# Altium schematic sheet filters.SchDoc
size 381 x 241 mm; SheetNumber: 5; SheetTotal: 12
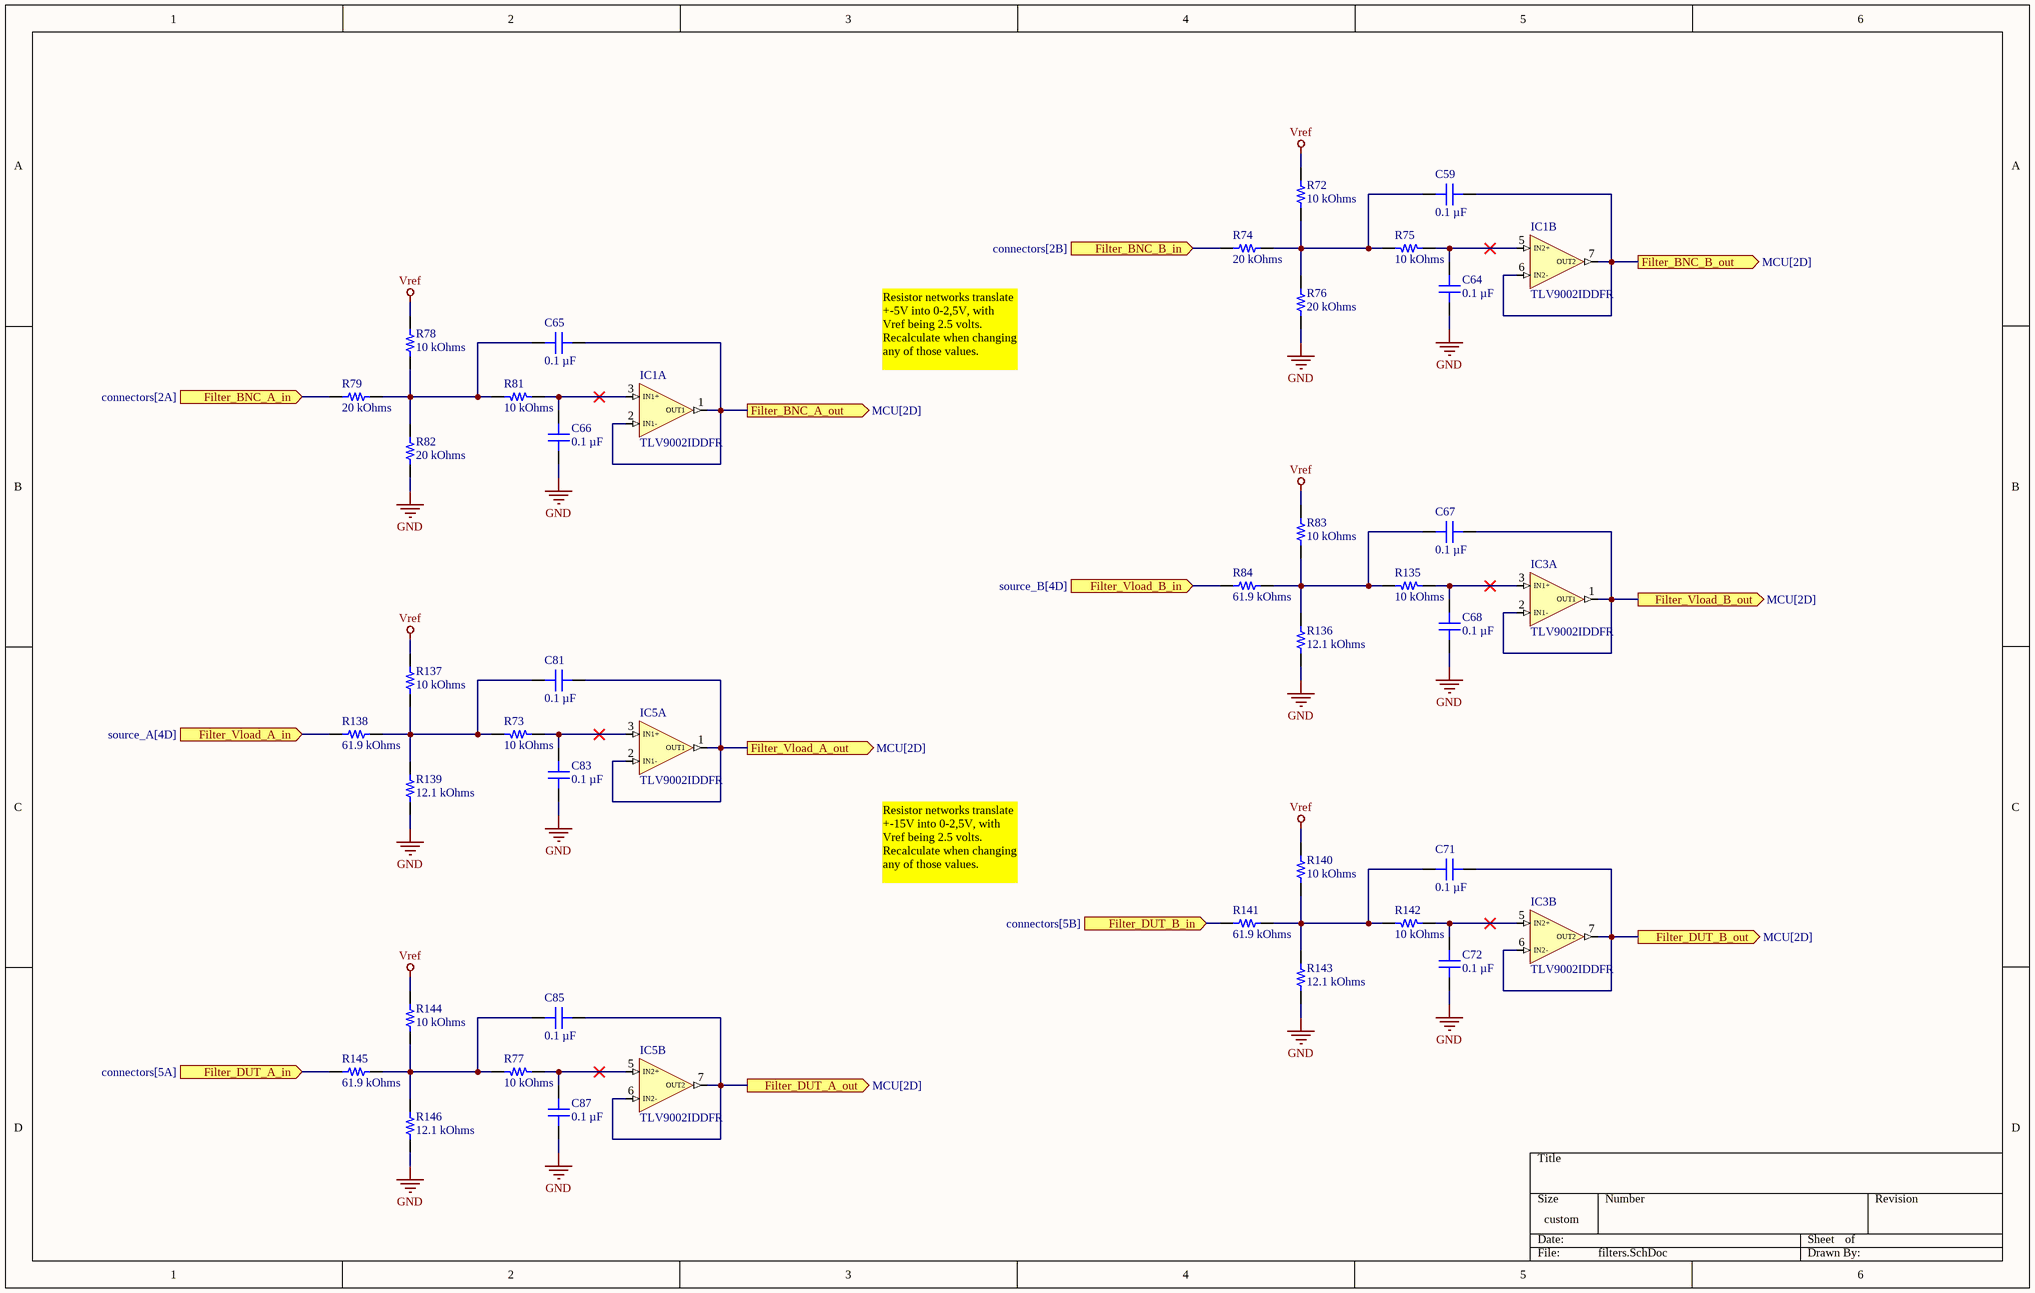
[diagram p0: filters.SchDoc]

## Parts
C59  0.1 µF  [CAP 1206_3216 - 0.8MM]
C64  0.1 µF  [CAP 1206_3216 - 0.8MM]
C65  0.1 µF  [CAP 1206_3216 - 0.8MM]
C66  0.1 µF  [CAP 1206_3216 - 0.8MM]
C67  0.1 µF  [CAP 1206_3216 - 0.8MM]
C68  0.1 µF  [CAP 1206_3216 - 0.8MM]
C71  0.1 µF  [CAP 1206_3216 - 0.8MM]
C72  0.1 µF  [CAP 1206_3216 - 0.8MM]
C81  0.1 µF  [CAP 1206_3216 - 0.8MM]
C83  0.1 µF  [CAP 1206_3216 - 0.8MM]
C85  0.1 µF  [CAP 1206_3216 - 0.8MM]
C87  0.1 µF  [CAP 1206_3216 - 0.8MM]
IC1  TLV9002IDDFR  [SOT65P280X110-8N]  (parts A,B of 3)
IC3  TLV9002IDDFR  [SOT65P280X110-8N]  (parts A,B of 3)
IC5  TLV9002IDDFR  [SOT65P280X110-8N]  (parts A,B of 3)
R72  10 kOhms  [RES 1206_3216]
R73  10 kOhms  [YAGEO RES 1206_3216]
R74  20 kOhms  [RES 1206_3216]
R75  10 kOhms  [YAGEO RES 1206_3216]
R76  20 kOhms  [RES 1206_3216]
R77  10 kOhms  [YAGEO RES 1206_3216]
R78  10 kOhms  [RES 1206_3216]
R79  20 kOhms  [RES 1206_3216]
R81  10 kOhms  [YAGEO RES 1206_3216]
R82  20 kOhms  [RES 1206_3216]
R83  10 kOhms  [RES 1206_3216]
R84  61.9 kOhms  [RES 1206_3216]
R135  10 kOhms  [YAGEO RES 1206_3216]
R136  12.1 kOhms  [RES 1206_3216]
R137  10 kOhms  [RES 1206_3216]
R138  61.9 kOhms  [RES 1206_3216]
R139  12.1 kOhms  [RES 1206_3216]
R140  10 kOhms  [RES 1206_3216]
R141  61.9 kOhms  [RES 1206_3216]
R142  10 kOhms  [YAGEO RES 1206_3216]
R143  12.1 kOhms  [RES 1206_3216]
R144  10 kOhms  [RES 1206_3216]
R145  61.9 kOhms  [RES 1206_3216]
R146  12.1 kOhms  [RES 1206_3216]

## Ports
Filter_BNC_A_in (in, see connectors[2A]), Filter_BNC_A_out (out, see MCU[2D]), Filter_BNC_B_in (in, see connectors[2B]), Filter_BNC_B_out (out, see MCU[2D]), Filter_DUT_A_in (in, see connectors[5A]), Filter_DUT_A_out (out, see MCU[2D]), Filter_DUT_B_in (in, see connectors[5B]), Filter_DUT_B_out (out, see MCU[2D]), Filter_Vload_A_in (in, see source_A[4D]), Filter_Vload_A_out (out, see MCU[2D]), Filter_Vload_B_in (in, see source_B[4D]), Filter_Vload_B_out (out, see MCU[2D])

## Nets
GND: C64.2 C66.2 C68.2 C72.2 C83.2 C87.2 R76.2 R82.2 R136.2 R139.2 R143.2 R146.2
Vref: R72.1 R78.1 R83.1 R137.1 R140.1 R144.1
Filter_BNC_A_in: R79.1 ; port Filter_BNC_A_in
Filter_BNC_A_out: C65.1 IC1.1(OUT1) IC1.2(IN1-) ; port Filter_BNC_A_out
Filter_BNC_B_in: R74.1 ; port Filter_BNC_B_in
Filter_BNC_B_out: C59.1 IC1.6(IN2-) IC1.7(OUT2) ; port Filter_BNC_B_out
Filter_DUT_A_in: R145.1 ; port Filter_DUT_A_in
Filter_DUT_A_out: C85.1 IC5.6(IN2-) IC5.7(OUT2) ; port Filter_DUT_A_out
Filter_DUT_B_in: R141.1 ; port Filter_DUT_B_in
Filter_DUT_B_out: C71.1 IC3.6(IN2-) IC3.7(OUT2) ; port Filter_DUT_B_out
Filter_Vload_A_in: R138.1 ; port Filter_Vload_A_in
Filter_Vload_A_out: C81.1 IC5.1(OUT1) IC5.2(IN1-) ; port Filter_Vload_A_out
Filter_Vload_B_in: R84.1 ; port Filter_Vload_B_in
Filter_Vload_B_out: C67.1 IC3.1(OUT1) IC3.2(IN1-) ; port Filter_Vload_B_out
NetC59_2: C59.2 R72.2 R74.2 R75.2 R76.1
NetC64_1: C64.1 IC1.5(IN2+) R75.1
NetC65_2: C65.2 R78.2 R79.2 R81.2 R82.1
NetC66_1: C66.1 IC1.3(IN1+) R81.1
NetC67_2: C67.2 R83.2 R84.2 R135.2 R136.1
NetC68_1: C68.1 IC3.3(IN1+) R135.1
NetC71_2: C71.2 R140.2 R141.2 R142.2 R143.1
NetC72_1: C72.1 IC3.5(IN2+) R142.1
NetC81_2: C81.2 R73.2 R137.2 R138.2 R139.1
NetC83_1: C83.1 IC5.3(IN1+) R73.1
NetC85_2: C85.2 R77.2 R144.2 R145.2 R146.1
NetC87_1: C87.1 IC5.5(IN2+) R77.1

## Notes on the sheet
- Resistor networks translate +-5V into 0-2,5V, with Vref being 2.5 volts. Recalculate when changing any of those values.
- Resistor networks translate +-15V into 0-2,5V, with Vref being 2.5 volts. Recalculate when changing any of those values.

## Library data of the parts
C59 C64-C68 C71 C72 C81 C83 C85 C87 = 885012208087: CAP CER 0.1UF 50V X7R 1206; manufacturer: Würth Elektronik; Tolerance: ±10%; Part Number: 885012208087; Capacitance: 0.1 µF; Applications: General Purpose; componentlink1description: Datasheet; componentlink1url: https://katalog.we-online.de/pbs/datasheet/885012208087.pdf; componentlink2description: DigiKey Link; componentlink2url: https://www.digikey.com/en/products/detail/würth-elektronik/885012208087/5453982; Device Package: 1206 (3216 Metric); lastupdated: 6/4/2024 19:10:27; Lifecycle Status: Active; Minimum Order: 1; Mounting Type: Surface Mount, MLCC; Operating Temperature: -55°C ~ 125°C; Package / Case: 1206 (3216 Metric); packaging: TapeAndReel; partid: 20879; Part Status: Active; price: 0.06; series: WCAP-CSGP; Size / Dimension: 0.126" L x 0.063" W (3.20mm x 1.60mm); Supplier 1: DigiKey; Supplier Part Number 1: 732-8127-1-ND; Temperature Coefficient: X7R; Thickness (Max): 0.035" (0.90mm); value: 0.1 µF; Voltage - Rated: 50V
IC1 IC3 IC5 = TLV9002IDDFR: Integrated Circuit; Manufacturer_Name: Texas Instruments; Datasheet Link: https://www.ti.com/lit/gpn/TLV9002; Height: 1.1mm; Manufacturer_Part_Number: TLV9002IDDFR; Mouser Part Number: 595-TLV9002IDDFR; Mouser Price/Stock: https://www.mouser.co.uk/ProductDetail/Texas-Instruments/TLV9002IDDFR?qs=mAH9sUMRCtuVJ6NmNV%252Bgrw%3D%3D; Arrow Part Number: TLV9002IDDFR; Arrow Price/Stock: https://www.arrow.com/en/products/tlv9002iddfr/texas-instruments?utm_currency=USD&region=nac
R72 R78 R83 R137 R140 R144 = ERA-8AEB103V: RES SMD 10K OHM 0.1% 1/4W 1206; Manufacturer: Panasonic Electronic Components; Power (Watts): 0.25W, 1/4W; Temperature Coefficient: ±25ppm/°C; Part Number: ERA-8AEB103V; ComponentLink1Description: Datasheet; ComponentLink1URL: https://industrial.panasonic.com/cdbs/www-data/pdf/RDM0000/AOA0000C307.pdf; ComponentLink2Description: DigiKey Link; ComponentLink2URL: https://www.digikey.com/en/products/detail/panasonic-electronic-components/ERA-8AEB103V/3070742; Composition: Thin Film; Device Package: 1206 (3216 Metric); Features: Automotive AEC-Q200; Height - Seated (Max): 0.028" (0.70mm); LastUpdated: 2/9/2024 20:54:17; Lifecycle Status: Active; Minimum Order: 1; Number of Terminations: 2; Operating Temperature: -55°C ~ 155°C; Package / Case: 1206 (3216 Metric); Packaging: TapeAndReel; PartId: 33990; Part Status: Active; Price: 0.10; Ratings: AEC-Q200; Resistance: 10 kOhms; Series: ERA-8A; Size / Dimension: 0.126" L x 0.063" W (3.20mm x 1.60mm); Supplier 1: DigiKey; Supplier Part Number 1: P10KBCCT-ND; Supplier Device Package: 1206; Tolerance: ±0.1%; Value: 10 kOhms
R73 R75 R77 R81 R135 R142 = RT1206FRE0710KL: RES SMD 10K OHM 1% 1/4W 1206; Manufacturer: Yageo; Power (Watts): 0.25W, 1/4W; Temperature Coefficient: ±50ppm/°C; Part Number: RT1206FRE0710KL; ComponentLink1Description: Datasheet; ComponentLink1URL: https://www.yageo.com/upload/media/product/productsearch/datasheet/rchip/PYu-RT_1-to-0.01_RoHS_L_11.pdf; ComponentLink2Description: DigiKey Link; ComponentLink2URL: https://www.digikey.com/en/products/detail/yageo/RT1206FRE0710KL/1082868; Composition: Thin Film; Device Package: 1206 (3216 Metric); Height - Seated (Max): 0.026" (0.65mm); LastUpdated: 7/25/2024 09:21:28; Lifecycle Status: Active; Minimum Order: 1; Number of Terminations: 2; Operating Temperature: -55°C ~ 155°C; Package / Case: 1206 (3216 Metric); Packaging: TapeAndReel; PartId: 38903; Part Status: Active; Price: 0.01; Resistance: 10 kOhms; Series: RT; Size / Dimension: 0.122" L x 0.063" W (3.10mm x 1.60mm); Supplier 1: DigiKey; Supplier Part Number 1: YAG1242CT-ND; Supplier Device Package: 1206; Tolerance: ±1%; Value: 10 kOhms
R74 R76 R79 R82 = ERA-8AEB203V: RES SMD 20K OHM 0.1% 1/4W 1206; Manufacturer: Panasonic Electronic Components; Power (Watts): 0.25W, 1/4W; Temperature Coefficient: ±25ppm/°C; Part Number: ERA-8AEB203V; ComponentLink1Description: Datasheet; ComponentLink1URL: https://industrial.panasonic.com/cdbs/www-data/pdf/RDM0000/AOA0000C307.pdf; ComponentLink2Description: DigiKey Link; ComponentLink2URL: https://www.digikey.com/en/products/detail/panasonic-electronic-components/ERA-8AEB203V/3070867; Composition: Thin Film; Device Package: 1206 (3216 Metric); Features: Automotive AEC-Q200; Height - Seated (Max): 0.028" (0.70mm); LastUpdated: 2/9/2024 20:54:17; Lifecycle Status: Active; Minimum Order: 1; Number of Terminations: 2; Operating Temperature: -55°C ~ 155°C; Package / Case: 1206 (3216 Metric); Packaging: TapeAndReel; PartId: 33988; Part Status: Active; Price: 0.10; Ratings: AEC-Q200; Resistance: 20 kOhms; Series: ERA-8A; Size / Dimension: 0.126" L x 0.063" W (3.20mm x 1.60mm); Supplier 1: DigiKey; Supplier Part Number 1: P20KBCCT-ND; Supplier Device Package: 1206; Tolerance: ±0.1%; Value: 20 kOhms
R84 R138 R141 R145 = ERA-8AEB6192V: RES SMD 61.9K OHM 0.1% 1/4W 1206; Manufacturer: Panasonic Electronic Components; Power (Watts): 0.25W, 1/4W; Temperature Coefficient: ±25ppm/°C; Part Number: ERA-8AEB6192V; ComponentLink1Description: Datasheet; ComponentLink1URL: https://industrial.panasonic.com/cdbs/www-data/pdf/RDM0000/AOA0000C307.pdf; ComponentLink2Description: DigiKey Link; ComponentLink2URL: https://www.digikey.com/en/products/detail/panasonic-electronic-components/ERA-8AEB6192V/3071114; Composition: Thin Film; Device Package: 1206 (3216 Metric); Features: Automotive AEC-Q200; Height - Seated (Max): 0.028" (0.70mm); LastUpdated: 2/9/2024 20:53:52; Lifecycle Status: Active; Minimum Order: 1; Number of Terminations: 2; Operating Temperature: -55°C ~ 155°C; Package / Case: 1206 (3216 Metric); Packaging: TapeAndReel; PartId: 41065; Part Status: Active; Price: 0.10; Ratings: AEC-Q200; Resistance: 61.9 kOhms; Series: ERA-8A; Size / Dimension: 0.126" L x 0.063" W (3.20mm x 1.60mm); Supplier 1: DigiKey; Supplier Part Number 1: P61.9KBCCT-ND; Supplier Device Package: 1206; Tolerance: ±0.1%; Value: 61.9 kOhms
R136 R139 R143 R146 = ERA-8AEB1212V: RES SMD 12.1K OHM 0.1% 1/4W 1206; Manufacturer: Panasonic Electronic Components; Power (Watts): 0.25W, 1/4W; Temperature Coefficient: ±25ppm/°C; Part Number: ERA-8AEB1212V; ComponentLink1Description: Datasheet; ComponentLink1URL: https://industrial.panasonic.com/cdbs/www-data/pdf/RDM0000/AOA0000C307.pdf; ComponentLink2Description: DigiKey Link; ComponentLink2URL: https://www.digikey.com/en/products/detail/panasonic-electronic-components/ERA-8AEB1212V/3070771; Composition: Thin Film; Device Package: 1206 (3216 Metric); Features: Automotive AEC-Q200; Height - Seated (Max): 0.028" (0.70mm); LastUpdated: 2/9/2024 20:54:30; Lifecycle Status: Active; Minimum Order: 1; Number of Terminations: 2; Operating Temperature: -55°C ~ 155°C; Package / Case: 1206 (3216 Metric); Packaging: TapeAndReel; PartId: 30396; Part Status: Active; Price: 0.10; Ratings: AEC-Q200; Resistance: 12.1 kOhms; Series: ERA-8A; Size / Dimension: 0.126" L x 0.063" W (3.20mm x 1.60mm); Supplier 1: DigiKey; Supplier Part Number 1: 10-ERA-8AEB1212VCT-ND; Supplier Device Package: 1206; Tolerance: ±0.1%; Value: 12.1 kOhms